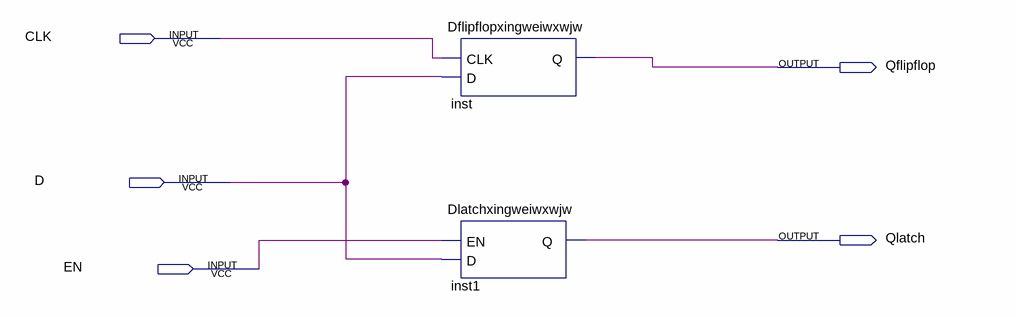
[diagram p0: schematic sheet]
// Quartus schematic wxwjw.bdf as structural Verilog: 2 symbols, 5 pins
module wxwjw (
  input  CLK,
  input  D,
  input  EN,
  output Qflipflop,
  output Qlatch
);

  Dflipflopxingweiwxwjw inst (.CLK(CLK), .D(D), .Q(Qflipflop));
  Dlatchxingweiwxwjw inst1 (.EN(EN), .D(D), .Q(Qlatch));
endmodule
